# EAGLE design Ilumitunes-Light-Controller-v10 (EAGLE 5.10)
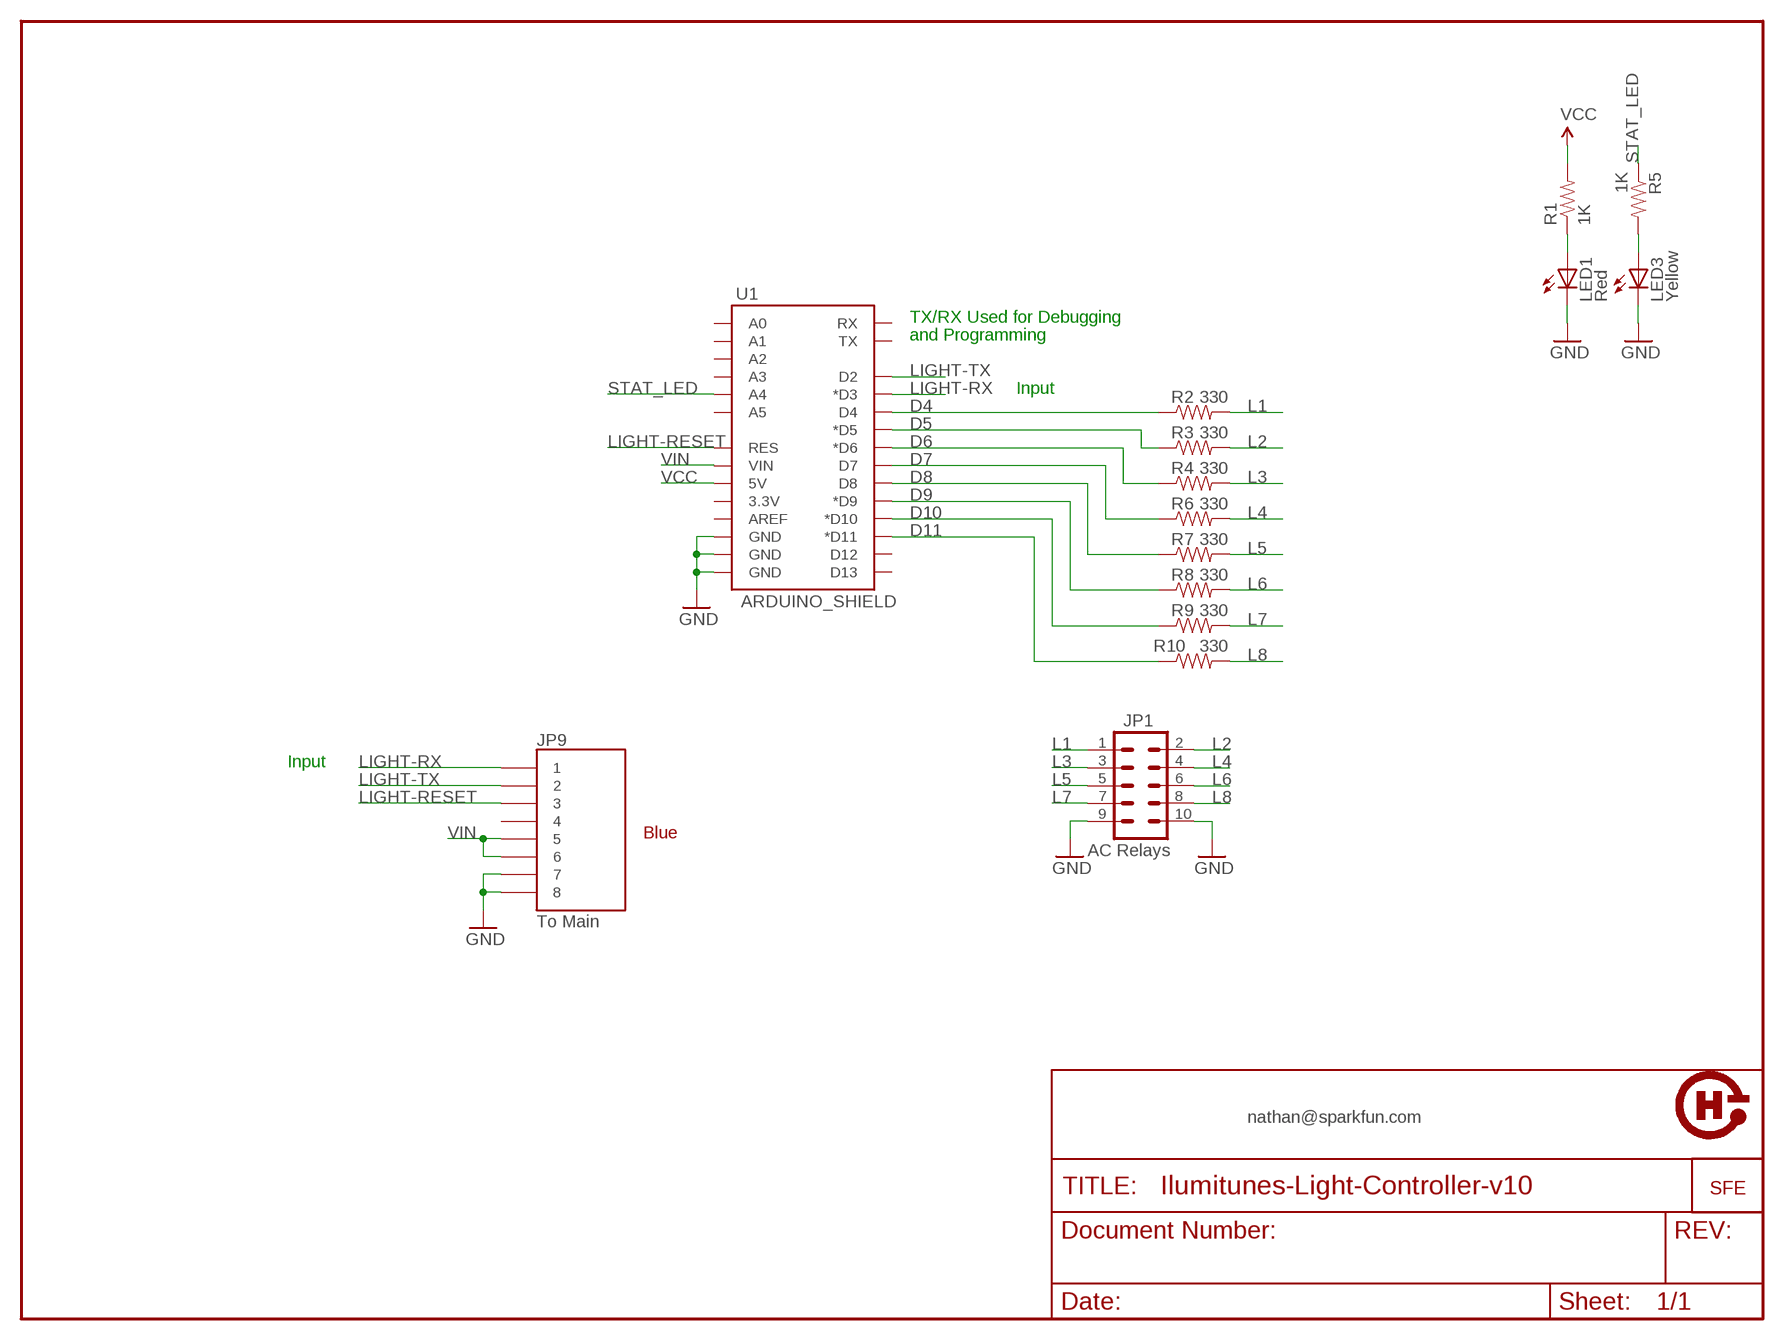
[diagram p0: schematic, sheet 1]

## Parts
JP1  AC Relays  M05X2SHD  [2X5-SHROUDED]
JP9  To Main  RJ45-8PTH  [RJ45-8]
LED1  Red  LED5MM  [LED5MM]
LED3  Yellow  LED5MM  [LED5MM]
R1  1K  RESISTORAXIAL-0.3  [AXIAL-0.3]
R2  330  RESISTORAXIAL-0.3  [AXIAL-0.3]
R3  330  RESISTORAXIAL-0.3  [AXIAL-0.3]
R4  330  RESISTORAXIAL-0.3  [AXIAL-0.3]
R5  1K  RESISTORAXIAL-0.3  [AXIAL-0.3]
R6  330  RESISTORAXIAL-0.3  [AXIAL-0.3]
R7  330  RESISTORAXIAL-0.3  [AXIAL-0.3]
R8  330  RESISTORAXIAL-0.3  [AXIAL-0.3]
R9  330  RESISTORAXIAL-0.3  [AXIAL-0.3]
R10  330  RESISTORAXIAL-0.3  [AXIAL-0.3]
U1  ARDUINO_SHIELD  ARDUINO_SHIELDLABEL  [DUEMILANOVE_SHIELD]
U$1  LOGO-SFENEW  [SFE-NEW-WEBLOGO]
U$2  OSHW-LOGO  [OSHW-LOGO]

## Nets
D4: R2.P$1 U1.D4
D5: R3.P$1 U1.D5(*D5)
D6: R4.P$1 U1.D6(*D6)
D7: R6.P$1 U1.D7
D8: R7.P$1 U1.D8
D9: R8.P$1 U1.D9(*D9)
D10: R9.P$1 U1.D10(*D10)
D11: R10.P$1 U1.D11(*D11)
GND: JP1.9 JP1.10 JP9.7 JP9.8 LED1.K(C) LED3.K(C) U1.GND@0(GND) U1.GND@1(GND) U1.GND@2(GND)
L1: JP1.1 R2.P$2
L2: JP1.2 R3.P$2
L3: JP1.3 R4.P$2
L4: JP1.4 R6.P$2
L5: JP1.5 R7.P$2
L6: JP1.6 R8.P$2
L7: JP1.7 R9.P$2
L8: JP1.8 R10.P$2
LIGHT-RESET: JP9.3 U1.RES
LIGHT-RX: JP9.1 U1.D3(*D3)
LIGHT-TX: JP9.2 U1.D2
N$1: LED1.A R1.P$1
N$4: LED3.A R5.P$2
STAT_LED: R5.P$1 U1.A4
VCC [vcc]: R1.P$2 U1.5V
VIN: JP9.5 JP9.6 U1.VIN
Unconnected: JP9.4 U1.3.3V U1.A0 U1.A1 U1.A2 U1.A3 U1.A5 U1.AREF U1.D12 U1.D13 U1.RX U1.TX

## Notes on the sheet
- TX/RX Used for Debugging
- and Programming
- Input
- Input
- Blue
- nathan@sparkfun.com

## Library data of the parts
JP1 = SparkFun:M05X2: Header 5x2 Standard 10-pin dual row 0.1" header. Commonly used with AVR-ISP. Use with Spark Fun Electronics SKU: PRT-00778
JP9 = SparkFun:RJ45-8: RJ45 Jack Simple RJ45, 8-pin connection - connector for common Cat5, Cat5e, and Cat6 Ethernet cables. Footprint not yet proven in production. Connector sku is PRT-00643; Breakout PCB sku is BOB-00716.
LED1 LED3 = SparkFun:LED: LEDs Standard schematic elements and footprints for 5mm, 3mm, 1206, and 0603 sized LEDs. 5mm - Spark Fun Electronics SKU : COM-00529 (and others)
R1-R10 = SparkFun:RESISTOR: Resistor Basic schematic elements and footprints for 0603, 1206, and PTH resistors.
U1 = SparkFun:ARDUINO_SHIELD
U$1 = SparkFun:LOGO-SFE: Spark Fun Electronics PCB Logo This is the standard Spark Fun Electronics PCB logo.
U$2 = SparkFun:OSHW-LOGO: Open Source Hardware Logo This logo indicates the piece of hardware it is found on incorporates a OSHW license and/or adheres to the definition of open source hardware found here: http://freedomdefined.org/OSHW

## Net classes
1 vcc: width 0.254 mm

## Board
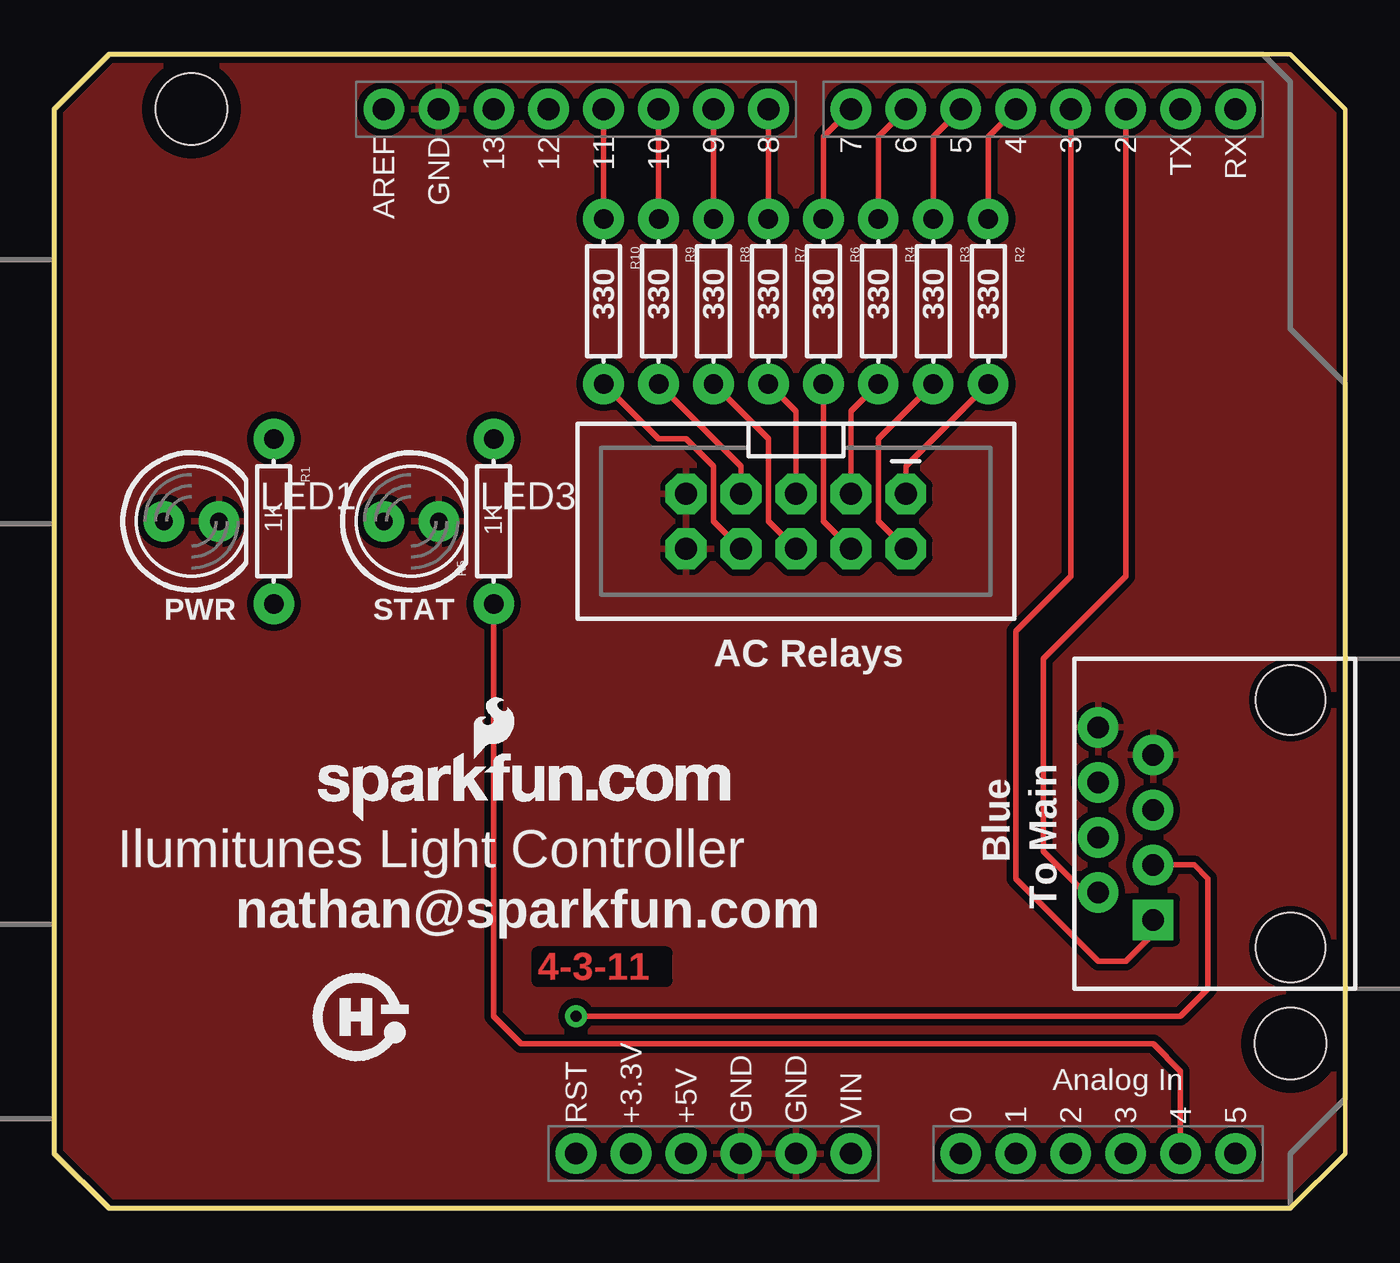
[diagram p1: board, top side]
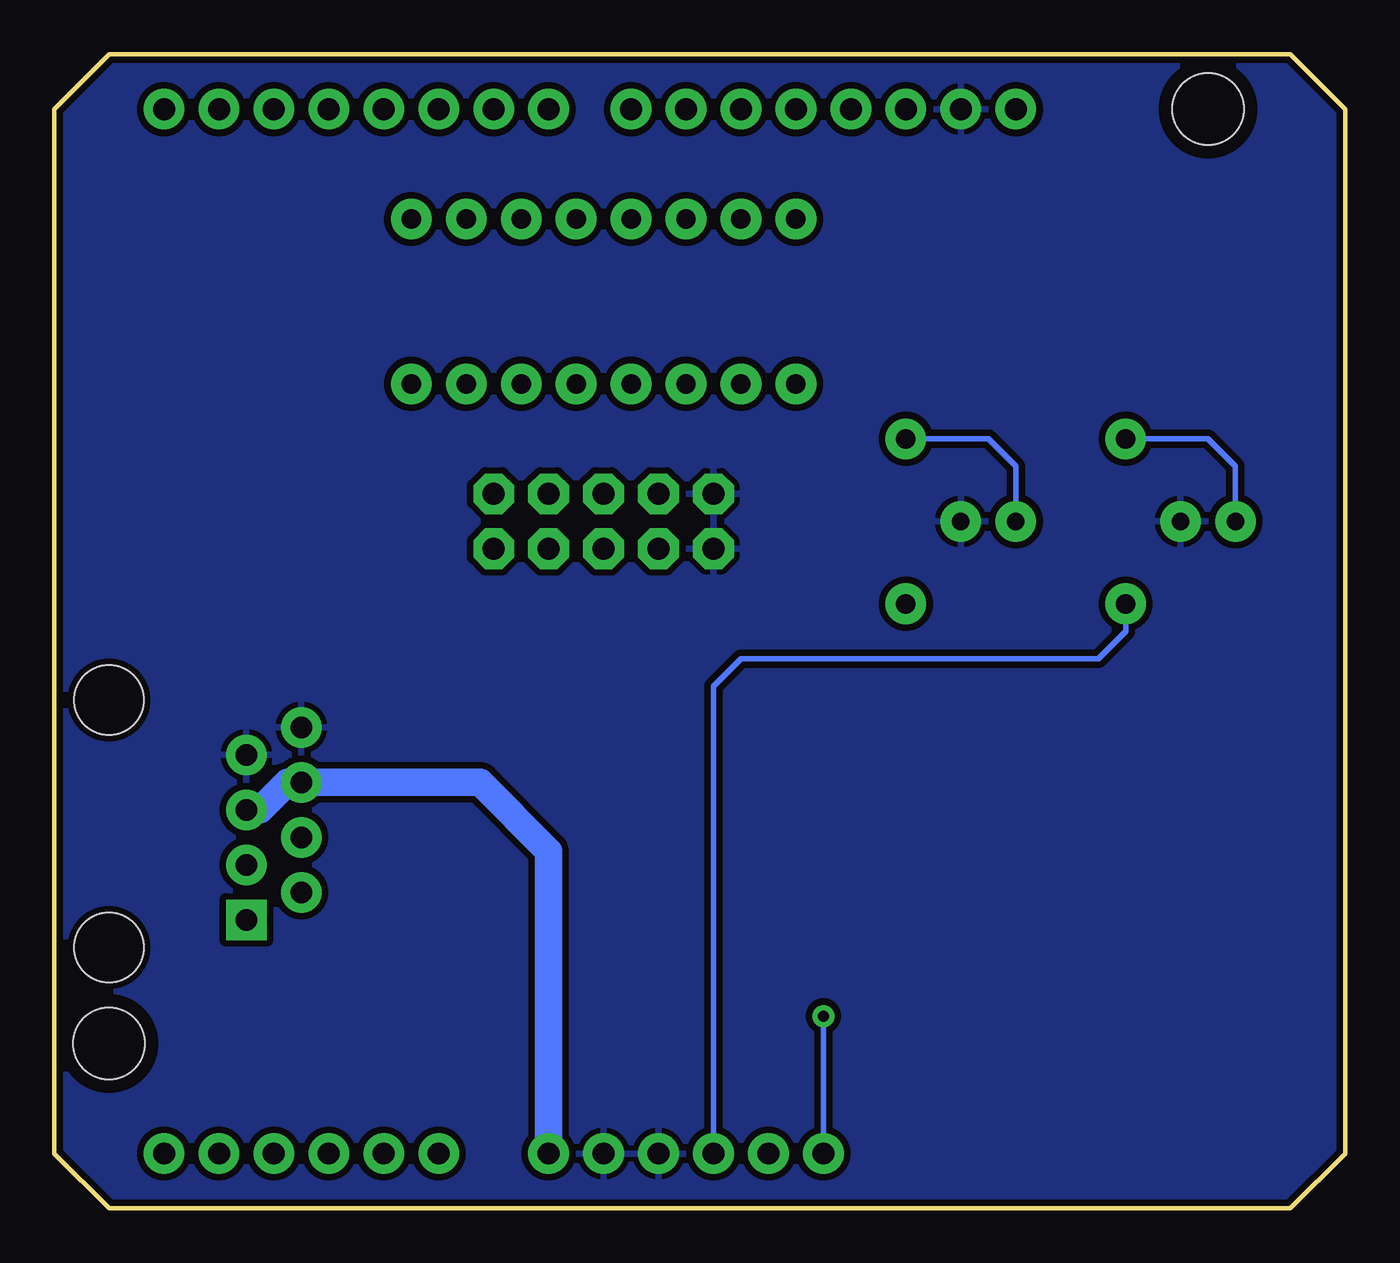
[diagram p2: board, bottom side, seen from below]

Size 59.69 x 53.34 mm. Coordinates in mm from the lower left corner, seen from the top.
Outline: 2.54,0 57.15,0 59.69,2.54 59.69,50.8 57.15,53.34 2.54,53.34 0,50.8 0,2.54 2.54,0
Copper layers (1*16): Top 0.035mm / dielectric 1.5mm / Bottom 0.035mm
Design rules "SparkFun *": minimum track width 10mil, minimum drill 20mil, track to track 8mil, track to pad 8mil, pad to pad 8mil, via to via 8mil, smd to smd 8mil, copper to edge 10mil, drill to drill 8mil, minimum pad ring 12mil, minimum via ring 10mil, stop-mask expansion 4mil, vias tented up to drill 25mil, thermal gap 10mil

### Footprints (pad centres in the part's own frame; a part is rotated, then mirrored left to right if it is on the bottom)
2X5-SHROUDED = drill 1.016 pad 1.88 octagon: 1 -1.27,5.08; 2 1.27,5.08; 3 -1.27,2.54; 4 1.27,2.54; 5 -1.27,0; 6 1.27,0; 7 -1.27,-2.54; 8 1.27,-2.54; 9 -1.27,-5.08; 10 1.27,-5.08
RJ45-8 = drill 1 pad 1.88 square: 1 -4.445,6.35 | drill 1 pad 1.88 round: 2 -3.175,8.89; 3 -1.905,6.35; 4 -0.635,8.89; 5 0.635,6.35; 6 1.905,8.89; 7 3.175,6.35; 8 4.445,8.89 | hole 3.2: -5.715,0; 5.715,0
LED5MM = drill 0.813 pad 1.88 round: A -1.27,0; K 1.27,0
AXIAL-0.3 = drill 0.9 pad 1.88 round: P$1 -3.81,0; P$2 3.81,0
DUEMILANOVE_SHIELD = drill 1.016 pad 1.88 round: 3.3V 50.8,26.67; 5V 50.8,29.21; A0 50.8,41.91; A1 50.8,44.45; A2 50.8,46.99; A3 50.8,49.53; A4 50.8,52.07; A5 50.8,54.61; AREF 2.54,15.24; D2 2.54,49.53; D3 2.54,46.99; D4 2.54,44.45; D5 2.54,41.91; D6 2.54,39.37; D7 2.54,36.83; D8 2.54,33.02; D9 2.54,30.48; D10 2.54,27.94; D11 2.54,25.4; D12 2.54,22.86; D13 2.54,20.32; GND@0 50.8,31.75; GND@1 50.8,34.29; GND@2 2.54,17.78; RES 50.8,24.13; RX 2.54,54.61; TX 2.54,52.07; VIN 50.8,36.83 | hole 3.302: 45.72,57.15; 2.54,6.35

### Placement (x,y rotation side)
JP1  34.29,31.75 270 top
JP9  57.15,17.78 90 top
LED1  6.35,31.75 0 top
LED3  16.51,31.75 0 top
R1  10.16,31.75 270 top
R2  43.18,41.91 270 top
R3  40.64,41.91 270 top
R4  38.1,41.91 270 top
R5  20.32,31.75 90 top
R6  35.56,41.91 270 top
R7  33.02,41.91 270 top
R8  30.48,41.91 270 top
R9  27.94,41.91 270 top
R10  25.4,41.91 270 top
U1  0,53.34 270 top
U$1  12.19,17.91 0 top
U$2  13.97,8.89 0 top

### Tracks (layer width: path | path; a pad name or v marks a point on that pad's centre or on a via)
D4
  Top 0.254: R2.P$1 43.18,49.53 U1.D4
D5
  Top 0.254: R3.P$1 40.64,49.53 U1.D5
D6
  Top 0.254: R4.P$1 38.1,49.53 U1.D6
D7
  Top 0.254: R6.P$1 35.56,49.53 U1.D7
D8
  Top 0.254: R7.P$1 U1.D8
D9
  Top 0.254: R8.P$1 U1.D9
D10
  Top 0.254: R9.P$1 U1.D10
D11
  Top 0.254: R10.P$1 U1.D11
GND
  pour Top (isolate 0.305): 0,0 0,53.34 59.69,53.34 59.69,0
  pour Bottom (isolate 0.305): 0,0 0,53.34 59.69,53.34 59.69,0
L1
  Top 0.254: JP1.1 39.37,34.29 R2.P$2
L2
  Top 0.254: JP1.2 38.1,31.75 38.1,35.56 R3.P$2
L3
  Top 0.254: JP1.3 36.83,36.83 R4.P$2
L4
  Top 0.254: JP1.4 35.56,31.75 R6.P$2
L5
  Top 0.254: JP1.5 34.29,36.83 R7.P$2
L6
  Top 0.254: JP1.6 33.02,31.75 33.02,35.56 R8.P$2
L7
  Top 0.254: JP1.7 31.75,34.29 R9.P$2
L8
  Top 0.254: JP1.8 30.48,31.75 30.48,34.29 29.21,35.56 27.94,35.56 R10.P$2
LIGHT-RESET  (via drill 0.51)
  Top 0.254: JP9.3 52.7,15.88 53.34,15.24 53.34,10.16 52.07,8.89 v24.13,8.89
  Bottom 0.254: U1.RES v24.13,8.89
LIGHT-RX
  Top 0.254: JP9.1 50.8,12.7 49.53,11.43 48.26,11.43 44.45,15.24 44.45,26.67 46.99,29.21 U1.D3
LIGHT-TX
  Top 0.254: JP9.2 47.62,14.61 45.72,16.51 45.72,25.4 49.53,29.21 U1.D2
N$1
  Bottom 0.254: LED1.A 5.08,34.29 6.35,35.56 R1.P$1
N$4
  Bottom 0.254: LED3.A 15.24,34.29 16.51,35.56 R5.P$2
STAT_LED
  Top 0.254: U1.A4 52.07,6.35 50.8,7.62 21.59,7.62 20.32,8.89 R5.P$1
VCC
  Bottom 0.254: U1.5V 29.21,24.13 27.94,25.4 11.43,25.4 10.16,26.67 R1.P$2
VIN
  Bottom 1.27: JP9.5 50.16,18.41 48.9,19.68 JP9.6 40.01,19.68 36.83,16.51 U1.VIN

### Text on the board
Top: 4-3-11
tPlace: PWR | STAT | AC Relays | Ilumitunes Light Controller | Blue | To Main | nathan@sparkfun.com